# EAGLE design Sch6 (EAGLE 9.5.2)
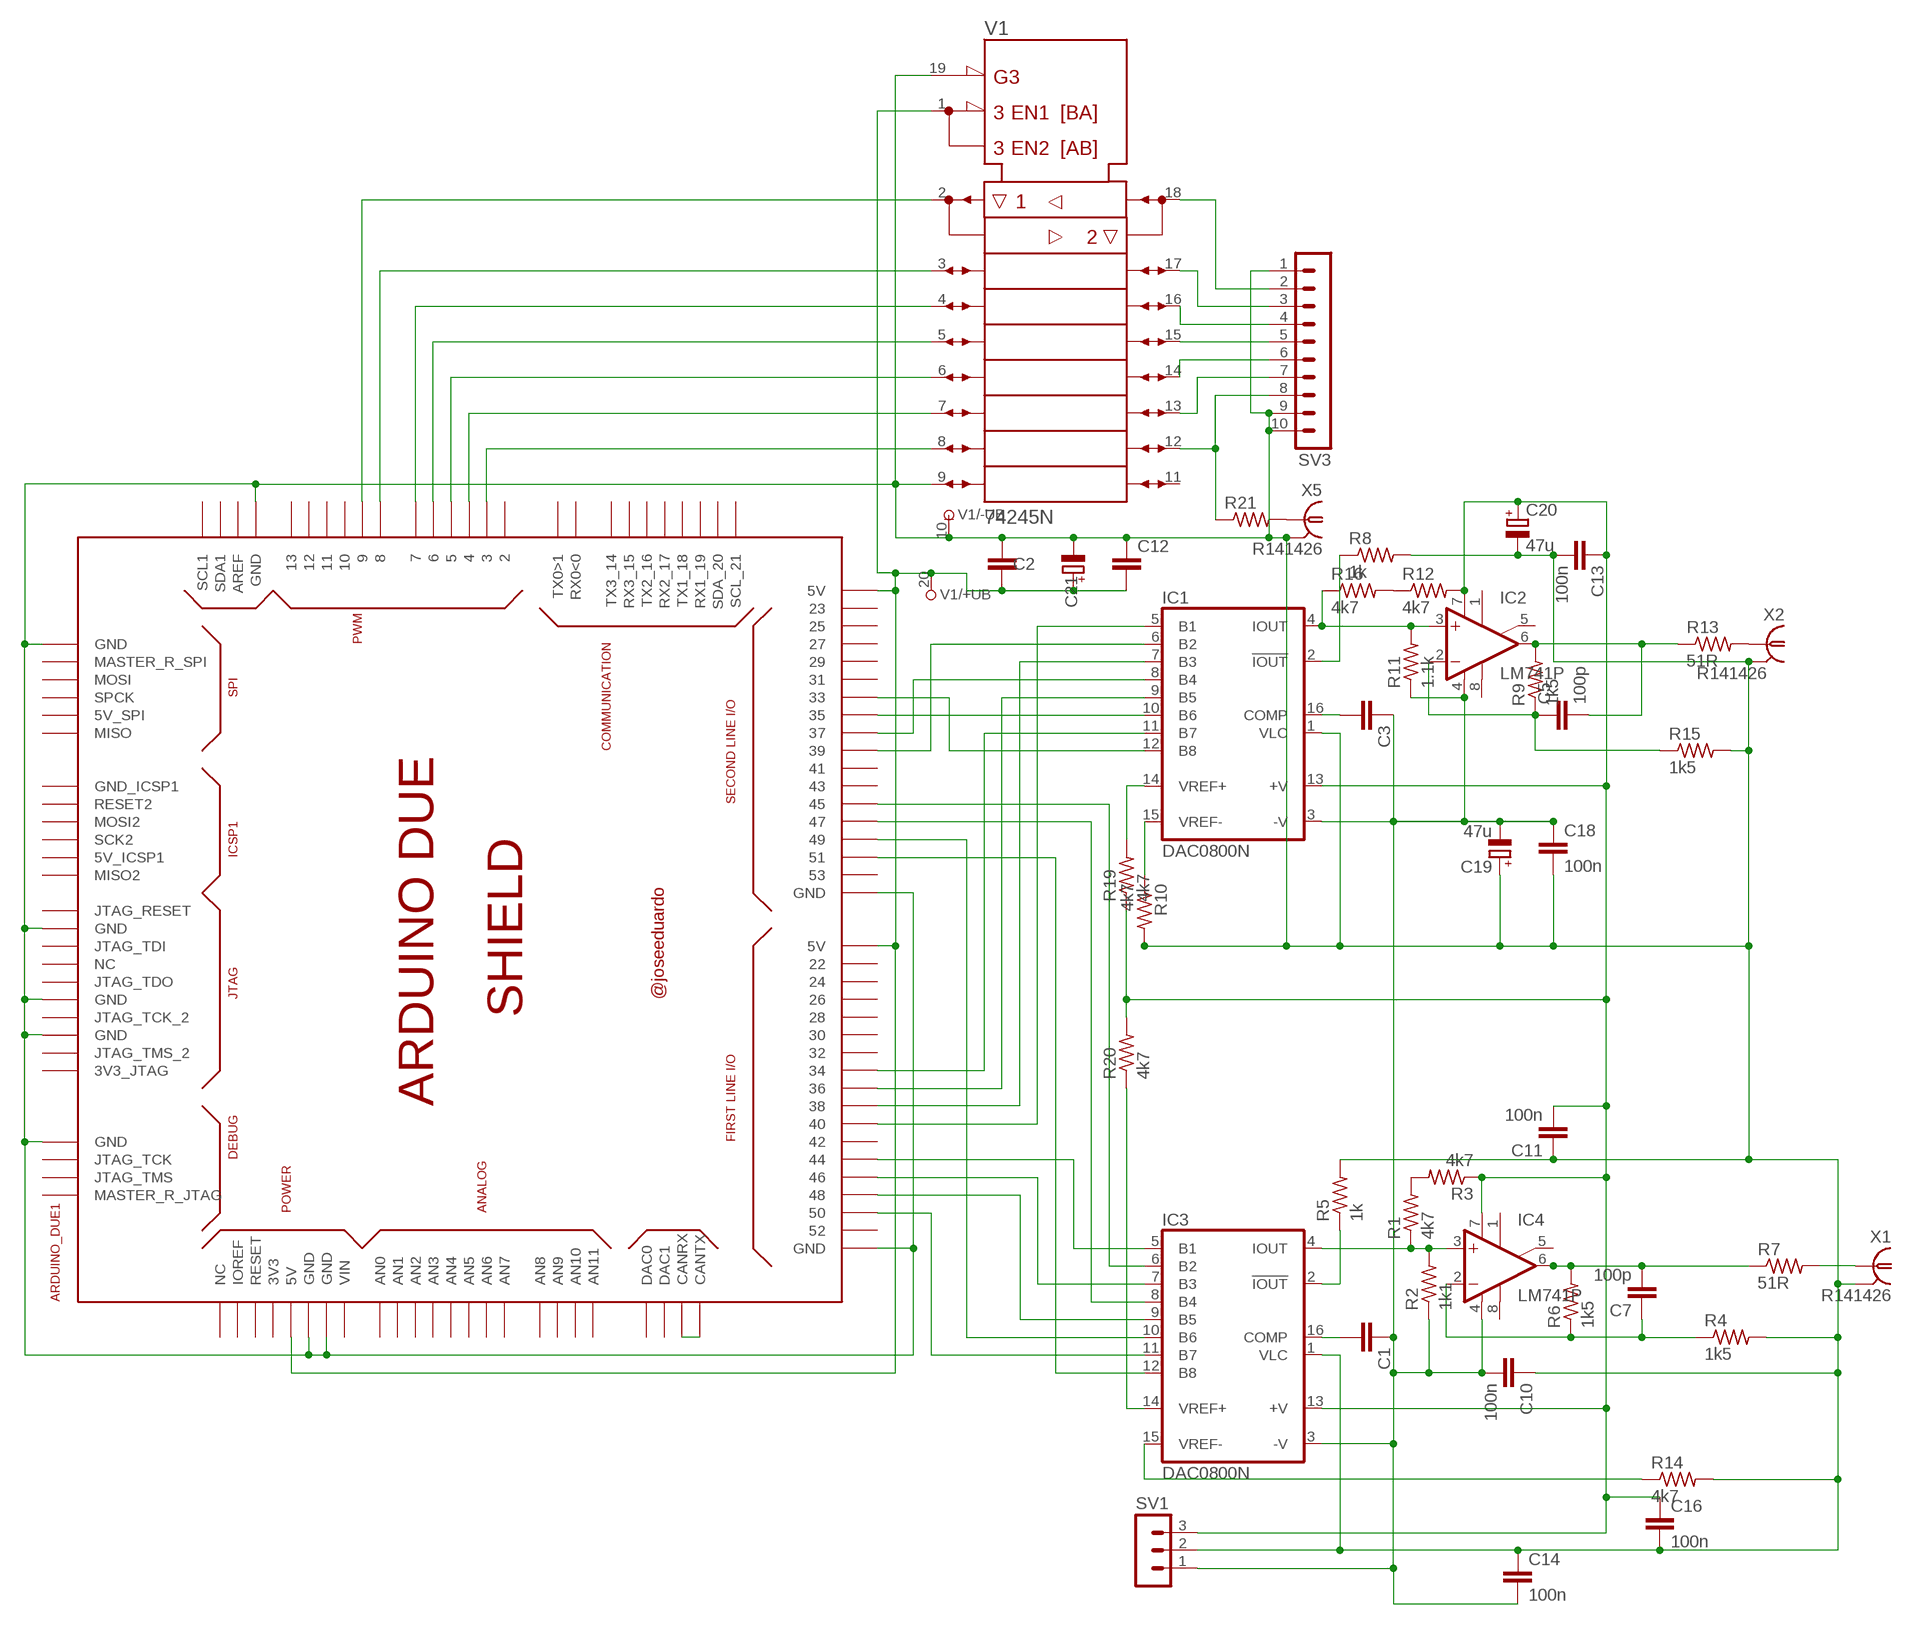
[diagram p0: schematic, sheet 1]

## Parts
ARDUINO_DUE1  ARDUINO_DUE_SHIELD  [ARDUINO_DUE_SHIELD]
C1  C-EU050-025X075  [C050-025X075]
C2  C-EU050-025X075  [C050-025X075]
C3  C-EU050-025X075  [C050-025X075]
C5  100p  C-EU050-025X075  [C050-025X075]
C7  100p  C-EU050-025X075  [C050-025X075]
C10  100n  C-EU050-025X075  [C050-025X075]
C11  100n  C-EU050-025X075  [C050-025X075]
C12  C-EU050-025X075  [C050-025X075]
C13  100n  C-EU050-025X075  [C050-025X075]
C14  100n  C-EU050-025X075  [C050-025X075]
C16  100n  C-EU050-025X075  [C050-025X075]
C18  100n  C-EU050-025X075  [C050-025X075]
C19  47u  CPOL-EUE5-10.5  [E5-10,5]
C20  47u  CPOL-EUE5-10.5  [E5-10,5]
C21  CPOL-EUE5-10.5  [E5-10,5]
IC1  DAC0800N  [DIL16]
IC2  LM741P  [DIL08]
IC3  DAC0800N  [DIL16]
IC4  LM741P  [DIL08]
R1  4k7  R-US_0207/10  [0207/10]
R2  1k1  R-US_0207/10  [0207/10]
R3  4k7  R-US_0207/10  [0207/10]
R4  1k5  R-US_0207/10  [0207/10]
R5  1k  R-US_0207/10  [0207/10]
R6  1k5  R-US_0207/10  [0207/10]
R7  51R  R-US_0207/10  [0207/10]
R8  1k  R-US_0207/10  [0207/10]
R9  1k5  R-US_0207/10  [0207/10]
R10  4k7  R-US_0207/10  [0207/10]
R11  1.1k  R-US_0207/10  [0207/10]
R12  4k7  R-US_0207/10  [0207/10]
R13  51R  R-US_0207/10  [0207/10]
R14  4k7  R-US_0207/10  [0207/10]
R15  1k5  R-US_0207/10  [0207/10]
R16  4k7  R-US_0207/10  [0207/10]
R19  4k7  R-US_0207/10  [0207/10]
R20  4k7  R-US_0207/10  [0207/10]
R21  R-US_0207/10  [0207/10]
SV1  MA03-1  [MA03-1]
SV3  MA10-1  [MA10-1]
V1  74245N  [DIL20]
X1  R141426  [R141426]
X2  R141426  [R141426]
X5  R141426  [R141426]

## Nets
N$1: ARDUINO_DUE1.51 IC3.12(B8)
N$2: R21.2 X5.1
N$3: ARDUINO_DUE1.33 IC1.12(B8)
N$4: IC1.2(!IOUT) R8.1
N$5: ARDUINO_DUE1.9 V1.2(A1)
N$6: ARDUINO_DUE1.34 IC1.11(B7)
N$7: ARDUINO_DUE1.50 IC3.11(B7)
N$8: ARDUINO_DUE1.35 IC1.10(B6)
N$9: ARDUINO_DUE1.36 IC1.9(B5)
N$10: ARDUINO_DUE1.37 IC1.8(B4)
N$11: ARDUINO_DUE1.49 IC3.10(B6)
N$12: ARDUINO_DUE1.CANRX ARDUINO_DUE1.CANTX
N$13: ARDUINO_DUE1.5V0(5V) ARDUINO_DUE1.5V0_1(5V) ARDUINO_DUE1.5V0_2(5V) C2.2 C12.2 C21.+ V1.1(DIR) V1.20(+UB)
N$14: ARDUINO_DUE1.38 IC1.7(B3)
N$15: ARDUINO_DUE1.39 IC1.6(B2)
N$16: ARDUINO_DUE1.8 V1.3(A2)
N$17: ARDUINO_DUE1.40 IC1.5(B1)
N$18: ARDUINO_DUE1.48 IC3.9(B5)
N$19: ARDUINO_DUE1.47 IC3.8(B4)
N$20: R1.2 R3.2
N$21: ARDUINO_DUE1.45 IC3.6(B2)
N$22: IC3.4(IOUT) IC4.3(+IN) R1.1 R2.2
N$23: ARDUINO_DUE1.7 V1.4(A3)
N$24: ARDUINO_DUE1.6 V1.5(A4)
N$25: ARDUINO_DUE1.5 V1.6(A5)
N$26: ARDUINO_DUE1.4 V1.7(A6)
N$27: ARDUINO_DUE1.3 V1.8(A7)
N$28: SV3.5 V1.15(B4)
N$29: SV3.6 V1.14(B5)
N$30: SV3.7 V1.13(B6)
N$31: R21.1 SV3.8 V1.12(B7)
N$32: SV3.4 V1.16(B3)
N$33: SV3.3 V1.17(B2)
N$34: SV3.2 V1.18(B1)
N$35: C11.2 C13.1 C16.1 C20.+ IC1.13(+V) IC2.7(V+) IC3.13(+V) IC4.7(V+) R3.1 R12.2 R19.1 R20.2 SV1.3
N$36: ARDUINO_DUE1.GND ARDUINO_DUE1.GND_1(GND) ARDUINO_DUE1.GND_2(GND) ARDUINO_DUE1.GND_3(GND) ARDUINO_DUE1.GND_4(GND) ARDUINO_DUE1.GND_5(GND) ARDUINO_DUE1.GND_7(GND) ARDUINO_DUE1.GND_8(GND) ARDUINO_DUE1.GND_9(GND) ARDUINO_DUE1.GND_10(GND) C2.1 C10.1 C11.1 C12.1 C13.2 C14.1 C16.2 C18.2 C19.+ C20.- C21.- IC1.1(VLC) IC3.1(VLC) R4.2 R5.2 R8.2 R10.2 R14.2 R15.2 SV1.2 SV3.1 SV3.9 SV3.10 V1.9(A8) V1.10(-UB) V1.19(!G) X1.2 X1.3 X1.4 X1.5 X2.2 X2.3 X2.4 X2.5 X5.2 X5.3 X5.4 X5.5
N$37: R12.1 R16.2
N$42: ARDUINO_DUE1.46 IC3.7(B3)
N$43: C3.2 IC1.16(COMP)
N$44: ARDUINO_DUE1.44 IC3.5(B1)
N$49: C1.2 IC3.16(COMP)
N$79: C5.1 IC2.2(-IN) R9.1 R15.1
N$80: IC1.4(IOUT) IC2.3(+IN) R11.2 R16.1
N$81: C7.1 IC4.2(-IN) R4.1 R6.1
N$112: IC3.2(!IOUT) R5.1
N$117: C1.1 C3.1 C10.2 C14.2 C18.1 C19.- IC1.3(-V) IC2.4(V-) IC3.3(-V) IC4.4(V-) R2.1 R11.1 SV1.1
N$119: C7.2 IC4.6(OUT) R6.2 R7.1
N$120: R7.2 X1.1
N$122: C5.2 IC2.6(OUT) R9.2 R13.1
N$123: R13.2 X2.1
N$126: IC1.15(VREF-) R10.1
N$127: IC3.15(VREF-) R14.1
N$133: IC1.14(VREF+) R19.2
N$134: IC3.14(VREF+) R20.1
Unconnected: ARDUINO_DUE1.0(RX0<0) ARDUINO_DUE1.1(TX0>1) ARDUINO_DUE1.2 ARDUINO_DUE1.3V3 ARDUINO_DUE1.3V3_JTAG ARDUINO_DUE1.5V_2(5V_SPI) ARDUINO_DUE1.5V_ICSP1 ARDUINO_DUE1.10 ARDUINO_DUE1.11 ARDUINO_DUE1.12 ARDUINO_DUE1.13 ARDUINO_DUE1.14(TX3_14) ARDUINO_DUE1.15(RX3_15) ARDUINO_DUE1.16(TX2_16) ARDUINO_DUE1.17(RX2_17) ARDUINO_DUE1.18(TX1_18) ARDUINO_DUE1.19(RX1_19) ARDUINO_DUE1.20(SDA_20) ARDUINO_DUE1.21(SCL_21) ARDUINO_DUE1.22 ARDUINO_DUE1.23 ARDUINO_DUE1.24 ARDUINO_DUE1.25 ARDUINO_DUE1.26 ARDUINO_DUE1.27 ARDUINO_DUE1.28 ARDUINO_DUE1.29 ARDUINO_DUE1.30 ARDUINO_DUE1.31 ARDUINO_DUE1.32 ARDUINO_DUE1.41 ARDUINO_DUE1.42 ARDUINO_DUE1.43 ARDUINO_DUE1.52 ARDUINO_DUE1.53 ARDUINO_DUE1.A0(AN0) ARDUINO_DUE1.A1(AN1) ARDUINO_DUE1.A2(AN2) ARDUINO_DUE1.A3(AN3) ARDUINO_DUE1.A4(AN4) ARDUINO_DUE1.A5(AN5) ARDUINO_DUE1.A6(AN6) ARDUINO_DUE1.A7(AN7) ARDUINO_DUE1.A8(AN8) ARDUINO_DUE1.A9(AN9) ARDUINO_DUE1.A10(AN10) ARDUINO_DUE1.A11(AN11) ARDUINO_DUE1.AREF ARDUINO_DUE1.DAC0 ARDUINO_DUE1.DAC1 ARDUINO_DUE1.GND_ICSP1 ARDUINO_DUE1.IOREF ARDUINO_DUE1.JTAG_RESET ARDUINO_DUE1.JTAG_TCK ARDUINO_DUE1.JTAG_TCK_2 ARDUINO_DUE1.JTAG_TDI ARDUINO_DUE1.JTAG_TDO ARDUINO_DUE1.JTAG_TMS ARDUINO_DUE1.JTAG_TMS_2 ARDUINO_DUE1.MASTER_RESET_JTAG(MASTER_R_JTAG) ARDUINO_DUE1.MASTER_RESET_SPI(MASTER_R_SPI) ARDUINO_DUE1.MISO ARDUINO_DUE1.MISO2 ARDUINO_DUE1.MOSI ARDUINO_DUE1.MOSI2 ARDUINO_DUE1.NC_2(NC) ARDUINO_DUE1.NC_5(NC) ARDUINO_DUE1.RESET ARDUINO_DUE1.RESET2 ARDUINO_DUE1.SCK2 ARDUINO_DUE1.SCL1 ARDUINO_DUE1.SDA1 ARDUINO_DUE1.SPCK ARDUINO_DUE1.VIN IC2.1(ON1) IC2.5(ON2) IC2.8(OPT) IC4.1(ON1) IC4.5(ON2) IC4.8(OPT) V1.11(B8)

## Library data of the parts
ARDUINO_DUE1 = arduino_due_shield:ARDUINO_DUE_SHIELD
C1-C3 C5 C7 C10-C14 C16 C18 = rcl:C-EU: CAPACITOR, European symbol; SPICEPREFIX: C
C19-C21 = rcl:CPOL-EU: POLARIZED CAPACITOR, European symbol; SPICEPREFIX: C
IC1 IC3 = linear:DAC0800: 8-bit DIGITAL/ANALOG CONVERTER
IC2 IC4 = linear:*741: OP AMP
R1-R16 R19-R21 = rcl:R-US_: RESISTOR, American symbol; SPICEPREFIX: R
SV1 = con-lstb:MA03-1: PIN HEADER; OC_FARNELL: unknown; OC_NEWARK: unknown
SV3 = con-lstb:MA10-1: PIN HEADER; OC_FARNELL: unknown; OC_NEWARK: unknown
V1 = 74ttl-din:74*245: Octal BUS TRANSCEIVER, 3-state
X1 X2 X5 = con-coax:R141426: BNC COAX CONNECTOR Radiall 50/75 Ohm Spoerle; MF: FARNELL; MPN: R141426161; OC_FARNELL: 4195115; OC_NEWARK: 14J7919

## Board
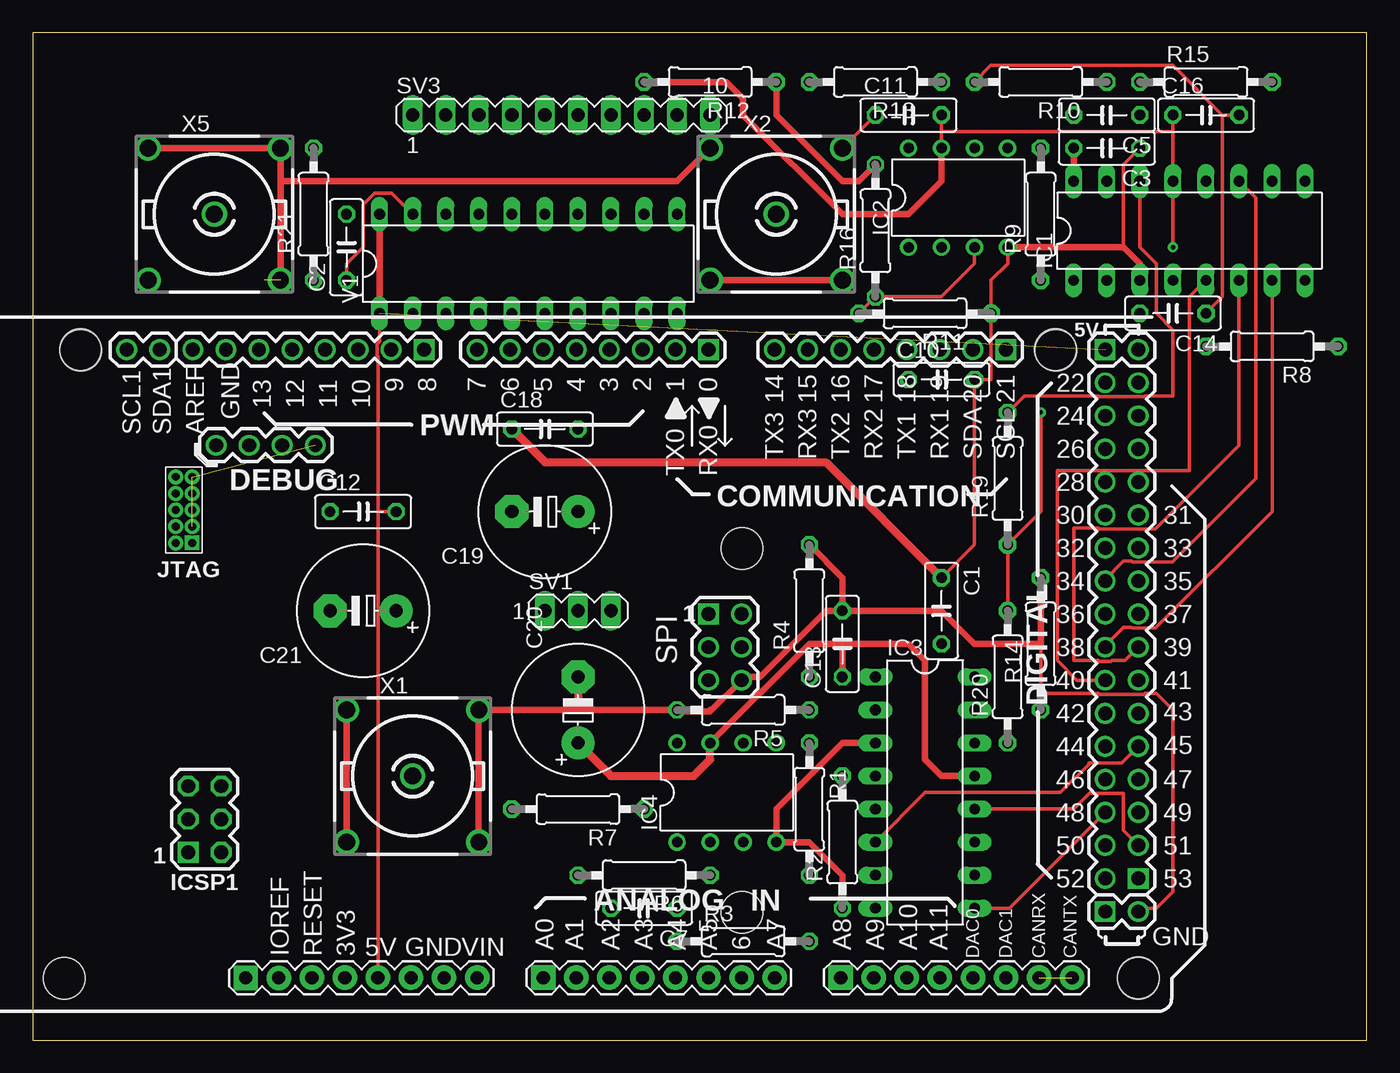
[diagram p1: board, top side]
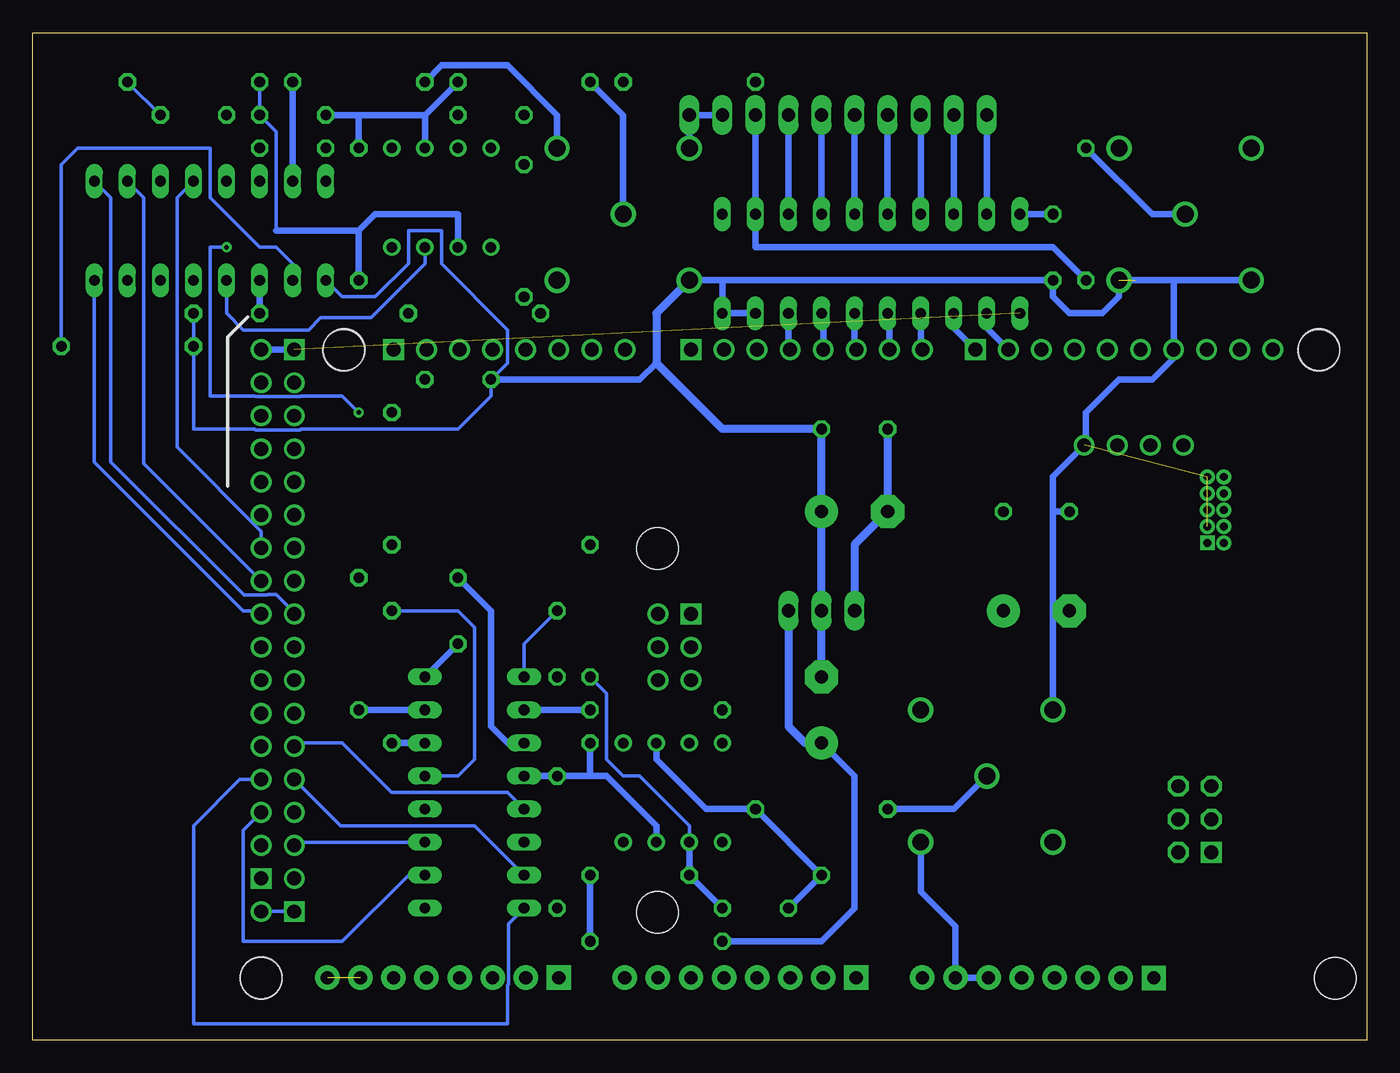
[diagram p2: board, bottom side, seen from below]

Size 102.54 x 77.46 mm. Coordinates in mm from the lower left corner, seen from the top.
Outline: 0,0 102.54,0 102.54,77.46 0,77.46 0,0
Copper layers (1*16): Top 0.035mm / dielectric 1.5mm / Bottom 0.035mm
Design rules "default": minimum track width 6mil, minimum drill 0.35mm, track to track 6mil, track to pad 6mil, pad to pad 6mil, via to via 6mil, smd to smd 6mil, copper to edge 40mil, drill to drill 6mil, minimum pad ring 10mil, minimum via ring 8mil, stop-mask expansion 4mil, vias tented up to drill 0mil, thermal gap 10mil

### Footprints (pad centres in the part's own frame; a part is rotated, then mirrored left to right if it is on the bottom)
ARDUINO_DUE_SHIELD = drill 1.067 square: 0 63.373,51.816; 5V0_1 93.853,51.816; 8 41.529,51.816; 21 86.233,51.816; 53 96.393,11.176; GND_2 93.853,8.636; MISO 63.373,31.496; MISO2 23.384,13.196 | drill 1.067: 1 60.833,51.816; 2 58.293,51.816; 3 55.753,51.816; 4 53.213,51.816; 5 50.673,51.816; 5V0_2 96.393,51.816; 5V_2 65.913,31.496; 6 48.133,51.816; 7 45.593,51.816; 9 38.989,51.816; 10 36.449,51.816; 11 33.909,51.816; 12 31.369,51.816; 13 28.829,51.816; 14 68.453,51.816; 15 70.993,51.816; 16 73.533,51.816; 17 76.073,51.816; 18 78.613,51.816; 19 81.153,51.816; 20 83.693,51.816; 22 93.853,49.276; 23 96.393,49.276; 24 93.853,46.736; 25 96.393,46.736; 26 93.853,44.196; 27 96.393,44.196; 28 93.853,41.656; 29 96.393,41.656; 30 93.853,39.116; 31 96.393,39.116; 32 93.853,36.576; 33 96.393,36.576; 34 93.853,34.036; 35 96.393,34.036; 36 93.853,31.496; 37 96.393,31.496; 38 93.853,28.956; 39 96.393,28.956; 40 93.853,26.416; 41 96.393,26.416; 42 93.853,23.876; 43 96.393,23.876; 44 93.853,21.336; 45 96.393,21.336; 46 93.853,18.796; 47 96.393,18.796; 48 93.853,16.256; 49 96.393,16.256; 50 93.853,13.716; 51 96.393,13.716; 52 93.853,11.176; AREF 23.749,51.816; GND_3 96.393,8.636; GND_4 26.289,51.816; GND_5 65.913,26.416; GND_7 33.161,44.473; JTAG_TCK 30.621,44.473; JTAG_TMS 28.081,44.473; MASTER_RESET_JTAG 25.541,44.473; MASTER_RESET_SPI 63.373,26.416; MOSI 65.913,28.956; SCL1 18.669,51.816; SDA1 21.209,51.816; SPCK 63.373,28.956 | drill 1.016 pad 1.88: 3V3 35.433,3.556; 5V0 37.973,3.556; A1 53.213,3.556; A2 55.753,3.556; A3 58.293,3.556; A4 60.833,3.556; A5 63.373,3.556; A6 65.913,3.556; A7 68.453,3.556; A9 76.073,3.556; A10 78.613,3.556; A11 81.153,3.556; CANRX 88.773,3.556; CANTX 91.313,3.556; DAC0 83.693,3.556; DAC1 86.233,3.556; GND 40.513,3.556; GND_1 43.053,3.556; IOREF 30.346,3.543; RESET 32.893,3.555; VIN 45.593,3.556 | drill 0.6 pad 1.016 square: 3V3_JTAG 23.689,36.964 | drill 1.067 octagon: 5V_ICSP1 25.924,13.196; GND_ICSP1 25.924,18.276; MOSI2 25.924,15.736; RESET2 23.384,18.276; SCK2 23.384,15.736 | drill 1.016 pad 1.88 square: A0 50.673,3.556; A8 73.533,3.556; NC_2 27.806,3.543 | drill 0.6 pad 1.143: GND_8 23.689,38.234; GND_9 23.689,40.774; GND_10 23.689,42.044; JTAG_RESET 22.419,42.044; JTAG_TCK_2 22.419,38.234; JTAG_TDI 22.419,40.774; JTAG_TDO 22.419,39.504; JTAG_TMS_2 22.419,36.964; NC_5 23.689,39.504 | hole 3.2: 15.113,51.816; 90.043,51.816; 96.393,3.556; 96.418,3.505; 15.138,51.765; 90.068,51.765; 13.868,3.505; 65.938,36.525; 65.938,8.585
C050-025X075 = drill 0.813 octagon: 1 -2.54,0; 2 2.54,0
E5-10,5 = drill 1.016 pad 2.54: + -2.54,0 | drill 1.016 pad 2.54 octagon: - 2.54,0
DIL16 = drill 0.813 long: 1 -8.89,-3.81; 2 -6.35,-3.81; 3 -3.81,-3.81; 4 -1.27,-3.81; 5 1.27,-3.81; 6 3.81,-3.81; 7 6.35,-3.81; 8 8.89,-3.81; 9 8.89,3.81; 10 6.35,3.81; 11 3.81,3.81; 12 1.27,3.81; 13 -1.27,3.81; 14 -3.81,3.81; 15 -6.35,3.81; 16 -8.89,3.81
DIL08 = drill 0.813 pad 1.27: 1 -3.81,-3.81; 2 -1.27,-3.81; 3 1.27,-3.81; 4 3.81,-3.81; 5 3.81,3.81; 6 1.27,3.81; 7 -1.27,3.81; 8 -3.81,3.81
0207/10 = drill 0.813 octagon: 1 -5.08,0; 2 5.08,0
MA03-1 = drill 1.016 long: 1 -2.54,0; 2 0,0; 3 2.54,0
MA10-1 = drill 1.016 long: 1 -11.43,0; 2 -8.89,0; 3 -6.35,0; 4 -3.81,0; 5 -1.27,0; 6 1.27,0; 7 3.81,0; 8 6.35,0; 9 8.89,0; 10 11.43,0
DIL20 = drill 0.813 long: 1 -11.43,-3.81; 2 -8.89,-3.81; 3 -6.35,-3.81; 4 -3.81,-3.81; 5 -1.27,-3.81; 6 1.27,-3.81; 7 3.81,-3.81; 8 6.35,-3.81; 9 8.89,-3.81; 10 11.43,-3.81; 11 11.43,3.81; 12 8.89,3.81; 13 6.35,3.81; 14 3.81,3.81; 15 1.27,3.81; 16 -1.27,3.81; 17 -3.81,3.81; 18 -6.35,3.81; 19 -8.89,3.81; 20 -11.43,3.81
R141426 = drill 1.295: 1 0,0; 2 5.08,5.08; 3 -5.08,5.08; 4 -5.08,-5.08; 5 5.08,-5.08

### Placement (x,y rotation side)
ARDUINO_DUE1  -11.43,1.27 0 top
C1  69.85,33.02 270 top
C2  24.13,60.96 90 top
C3  82.55,68.58 180 top
C5  82.55,71.12 180 top
C7  46.99,10.16 180 top
C10  69.85,50.8 0 top
C11  67.31,71.12 0 top
C12  25.4,40.64 0 top
C13  62.23,30.48 90 top
C14  87.63,55.88 180 top
C16  90.17,71.12 0 top
C18  39.37,46.99 0 top
C19  39.37,40.64 180 top
C20  41.91,25.4 90 top
C21  25.4,33.02 180 top
IC1  88.9,62.23 0 top
IC2  71.12,64.77 0 top
IC3  68.58,19.05 270 top
IC4  53.34,19.05 0 top
R1  59.69,17.78 270 top
R2  62.23,15.24 90 top
R3  54.61,7.62 0 top
R4  59.69,33.02 90 top
R5  54.61,25.4 180 top
R6  46.99,12.7 180 top
R7  41.91,17.78 180 top
R8  95.25,53.34 180 top
R9  77.47,63.5 90 top
R10  77.47,73.66 180 top
R11  68.58,55.88 180 top
R12  52.07,73.66 180 top
R13  64.77,73.66 180 top
R14  77.47,30.48 90 top
R15  90.17,73.66 0 top
R16  64.77,62.23 90 top
R19  74.93,43.18 90 top
R20  74.93,27.94 90 top
R21  21.59,63.5 90 top
SV1  41.91,33.02 0 top
SV3  40.64,71.12 0 top
V1  38.1,59.69 0 top
X1  29.21,20.32 0 top
X2  57.15,63.5 0 top
X5  13.97,63.5 0 top

### Tracks (layer width: path | path; a pad name or v marks a point on that pad's centre or on a via)
N$1
  Top 0.254: ARDUINO_DUE1.51 83.82,16.13 83.82,18.99 81.34,18.99 81.28,19.05 80.01,17.78 IC3.12
N$2
  Bottom 0.508: X5.1 16.51,63.5 R21.2
N$3
  Bottom 0.254: ARDUINO_DUE1.33 84.96,39.12 91.44,45.59 91.44,64.77 IC1.12
N$4
  Bottom 0.254: IC1.2 82.55,59.69 83.82,60.96 85.09,60.96 88.9,64.77 88.9,68.58 99.06,68.58 100.33,67.31 R8.1
N$5
  Bottom 0.508: ARDUINO_DUE1.9 29.21,54.74 V1.2
N$6
  Top 0.254: ARDUINO_DUE1.34 82.42,35.43 83.82,36.83 84.45,36.83 84.52,36.77 87.57,36.77 93.98,43.18 93.98,64.77 IC1.11
N$7
  Bottom 0.254: IC3.11 82.17,15.24 ARDUINO_DUE1.50
N$8
  Bottom 0.254: ARDUINO_DUE1.35 93.98,44.32 93.98,64.77 IC1.10
N$9
  Bottom 0.254: ARDUINO_DUE1.36 82.42,32.89 83.82,34.29 84.45,34.29 84.52,34.23 86.3,34.23 96.52,44.45 96.52,64.77 IC1.9
N$10
  Bottom 0.254: ARDUINO_DUE1.37 85.22,33.02 86.36,33.02 97.79,44.45 IC1.8
N$11
  Bottom 0.254: ARDUINO_DUE1.49 86.36,16.13 86.36,7.62 78.74,7.62 73.66,12.7 IC3.10
N$12  (1 unrouted)
N$13  (1 unrouted)
  Top 0.254: V1.1 26.67,53.72 26.48,53.53 26.48,52.64 26.54,52.58 26.54,40.64 | 26.54,40.64 26.54,33.02 | 26.54,33.02 ARDUINO_DUE1.5V0 | C21.+ 26.54,33.02 | C12.2 26.54,40.64
  Top 0.508: V1.20 V1.1
  Bottom 0.508: C2.2 V1.20 | ARDUINO_DUE1.5V0_2 ARDUINO_DUE1.5V0_1
N$14
  Top 0.254: ARDUINO_DUE1.38 82.42,30.35 83.82,31.75 84.45,31.75 84.52,31.69 86.3,31.69 95.25,40.64 IC1.7
N$15
  Top 0.254: IC1.6 92.71,45.72 86.3,39.31 81.98,39.31 81.91,39.37 80.01,39.37 80.01,29.21 81.91,29.21 81.98,29.15 82.87,29.15 82.93,29.21 83.95,29.21 ARDUINO_DUE1.39
N$16
  Bottom 0.508: ARDUINO_DUE1.8 31.75,54.74 V1.3
N$17
  Top 0.254: ARDUINO_DUE1.40 80.26,27.69 78.74,29.21 78.74,43.81 88.9,43.81 88.9,57.15 IC1.5
N$18
  Top 0.254: IC3.9 75.06,10.16 ARDUINO_DUE1.48
N$19
  Bottom 0.254: ARDUINO_DUE1.47 86.61,20.07 90.17,16.51 90.17,1.27 66.04,1.27 66.04,4.25 65.96,4.32 65.96,8.97 IC3.8
N$20
  Bottom 0.508: R1.2 R3.2
N$21
  Top 0.254: ARDUINO_DUE1.45 83.69,21.34 81.28,21.34 | 81.28,21.34 81.15,21.34 | IC3.6 68.58,19.05 78.99,19.05 81.28,21.34
N$22
  Bottom 0.508: IC4.3 54.61,16.51 58.42,20.32 59.69,20.32 | 59.69,20.32 R2.2 IC3.4 | R1.1 59.69,20.32
N$23
  Bottom 0.508: V1.4 34.29,53.21 ARDUINO_DUE1.7
N$24
  Bottom 0.508: ARDUINO_DUE1.6 36.7,55.75 V1.5
N$25
  Bottom 0.508: V1.6 39.37,53.21 ARDUINO_DUE1.5
N$26
  Bottom 0.508: ARDUINO_DUE1.4 41.78,55.75 V1.7
N$27
  Bottom 0.508: V1.8 44.45,53.21 ARDUINO_DUE1.3
N$28
  Bottom 0.508: V1.15 SV3.5
N$29
  Bottom 0.508: V1.14 SV3.6
N$30
  Bottom 0.508: V1.13 SV3.7
N$31
  Bottom 0.508: R21.1 24.13,60.96 46.99,60.96 V1.12 SV3.8
N$32
  Bottom 0.508: V1.16 SV3.4
N$33
  Bottom 0.508: V1.17 SV3.3
N$34
  Bottom 0.508: V1.18 SV3.2
N$35  (via drill 0.35)
  Top 0.254: R20.2 R19.1 77.47,40.64 v77.47,48.26 | 87.63,69.85 IC1.13 v87.63,60.96 | 87.63,69.85 69.85,69.85 IC2.7 C11.2 | C16.1 87.63,69.85
  Top 0.508: IC3.13 69.85,20.32 68.58,21.59 68.58,29.21 67.31,30.48 62.23,30.48 | 62.23,30.48 59.69,30.48 IC4.7 | C13.1 62.23,30.48 | R12.2 53.34,73.66 54.61,72.39 54.61,71.12 62.23,63.5 67.31,63.5 69.85,66.04 IC2.7
  Top 0.61: C20.+ 44.45,20.32 50.8,20.32 52.07,21.59 IC4.7
  Bottom 0.254: IC3.13 69.85,20.32 68.58,21.59 68.58,31.75 69.85,33.02 R20.2 | v87.63,60.96 88.9,60.96 88.9,49.53 85.47,49.53 85.41,49.47 81.98,49.47 81.91,49.53 78.74,49.53 v77.47,48.26
  Bottom 0.508: R3.1 41.91,7.62 39.37,10.16 39.37,20.32 C20.+
  Bottom 0.61: SV1.3 44.45,24.13 43.18,22.86 C20.+
N$36  (4 unrouted)
  Top 0.254: ARDUINO_DUE1.GND_3 85.22,10.16 86.36,10.16 87.63,11.43 87.63,25.4 86.36,26.67 85.47,26.67 85.41,26.61 81.98,26.61 81.91,26.67 77.47,26.67 77.47,30.48 | C11.1 X2.2 | 91.44,71.12 91.44,57.15 C14.1 | R10.2 73.66,74.93 87.63,74.93 91.44,71.12 | 91.44,71.12 C16.2 | C2.1 24.13,59.69 25.4,60.96 25.4,64.22 26.28,65.1 27.61,65.1 V1.19
  Top 0.508: 19.05,66.04 X5.2 X5.3 | 19.05,66.04 X5.5 | ARDUINO_DUE1.GND_5 54.48,27.81 | ARDUINO_DUE1.GND_5 52.07,25.27 | 52.07,25.4 52.07,25.27 | C13.2 69.85,33.02 72.39,30.48 77.47,30.48 R14.2 | X2.5 X2.4 | X1.5 X1.2 41.91,25.4 R5.2 49.66,25.27 52.07,25.27 | X2.3 49.53,66.04 19.05,66.04 | ARDUINO_DUE1.GND_5 54.74,27.94 55.88,27.94 60.96,33.02 C13.2 | R4.2 62.23,35.56 C13.2 | X1.3 X1.4
  Top 0.61: C20.- 41.91,25.4
  Bottom 0.254: ARDUINO_DUE1.GND_3 ARDUINO_DUE1.GND_2 | IC1.1 78.74,57.15 76.2,57.15 73.66,59.69 73.66,62.23 71.12,62.23 71.12,59.69 66.04,54.61 66.04,52.07 C10.1 67.31,49.53 69.85,46.99 81.91,46.99 81.98,46.93 85.41,46.93 85.47,46.99 90.17,46.99 C14.1 R8.2 | IC3.1 64.77,30.48 C13.2 | C16.2 R15.2
  Bottom 0.508: X5.4 17.78,58.42 | 49.53,58.42 V1.10 V1.9 | 49.53,58.42 C2.1 24.13,57.15 22.86,55.88 20.32,55.88 19.05,57.15 X5.5 14.86,58.42 ARDUINO_DUE1.GND_4 14.86,52.45 16.51,50.8 19.05,50.8 21.59,48.26 21.59,45.88 ARDUINO_DUE1.GND_7 24.13,43.34 24.13,40.64 | X1.5 34.29,11.43 31.62,8.76 ARDUINO_DUE1.GND_1 ARDUINO_DUE1.GND | 49.53,58.42 X2.4 | R10.2 71.12,74.93 66.04,74.93 62.23,71.12 X2.2 | X1.3 24.13,33.02 | 24.13,33.02 24.13,40.64 | C21.- 24.13,33.02 | C12.1 24.13,40.64 | SV3.1 V1.19 | SV3.9 SV3.10 X2.3 | C10.1 55.88,50.8 54.61,52.07
  Bottom 0.61: C20.- SV1.2 C19.+ C18.2 49.53,46.99 54.61,52.07 54.61,55.88 X2.4
N$37
  Top 0.508: R16.2 63.5,66.04 62.23,66.04 57.15,71.12 R12.1
N$42
  Bottom 0.254: IC3.7 68.58,16.51 78.87,16.51 ARDUINO_DUE1.46
N$43
  Top 0.508: C3.2 IC1.16
N$44
  Bottom 0.254: IC3.5 66.04,19.05 74.93,19.05 78.74,22.86 82.17,22.86 ARDUINO_DUE1.44
N$49
  Bottom 0.508: C1.2 IC3.16
N$79
  Bottom 0.254: 83.82,62.23 83.82,69.85 C5.1 R15.1
  Bottom 0.508: R9.1 77.47,62.23 | 83.82,62.23 77.47,62.23 | 77.47,62.23 76.2,63.5 69.85,63.5 IC2.2
N$80
  Top 0.254: IC2.3 72.39,59.69 69.85,57.15 R16.1 R11.2
  Bottom 0.254: IC1.4 87.63,55.88 86.36,54.61 81.34,54.61 80.4,55.55 76.53,55.55 72.39,59.69 IC2.3
N$81
  Bottom 0.254: IC4.2 52.07,16.51 55.88,20.32 57.15,20.32 58.42,21.59 58.42,26.67 R4.1
  Bottom 0.508: IC4.2 R6.1 C7.1
N$112
  Bottom 0.508: R5.1 IC3.2
N$117
  Top 0.254: C3.1 83.82,67.31 83.82,60.96 | IC2.4 74.93,59.69 73.66,58.42 R11.1 73.66,50.8 C10.2 72.39,38.1 C1.1
  Top 0.508: IC3.3 62.23,22.86 57.15,17.78 IC4.4 59.69,15.24 62.23,12.7 R2.1 | IC2.4 83.82,60.96 85.09,59.69 IC1.3
  Top 0.61: C18.1 39.37,44.45 60.96,44.45 C1.1
  Bottom 0.508: IC3.3 66.04,22.86 67.31,24.13 67.31,33.02 C1.1 | C14.2 IC1.3
  Bottom 0.61: C18.1 C19.- 39.37,38.1 SV1.1
N$119
  Bottom 0.508: IC4.6 54.61,21.59 50.8,17.78 R7.1 R6.2 C7.2
N$120
  Bottom 0.508: X1.1 31.75,17.78 R7.2
N$122
  Bottom 0.508: R13.1 72.39,71.12 | 72.39,71.12 IC2.6 | R9.2 77.47,71.12 | 77.47,71.12 72.39,71.12 | C5.2 77.47,71.12
N$123
  Bottom 0.508: X2.1 57.15,71.12 R13.2
N$126
  Bottom 0.508: R10.1 IC1.15
N$127
  Bottom 0.508: IC3.15 R14.1
N$133
  Top 0.254: IC1.14 85.09,60.96 86.36,59.69 86.36,55.88 87.63,54.61 87.63,49.53 85.47,49.53 85.41,49.47 81.98,49.47 81.91,49.53 76.2,49.53 R19.2
N$134
  Bottom 0.508: IC3.14 R20.1